# EAGLE design blink1_v2c3 (EAGLE 6.4)
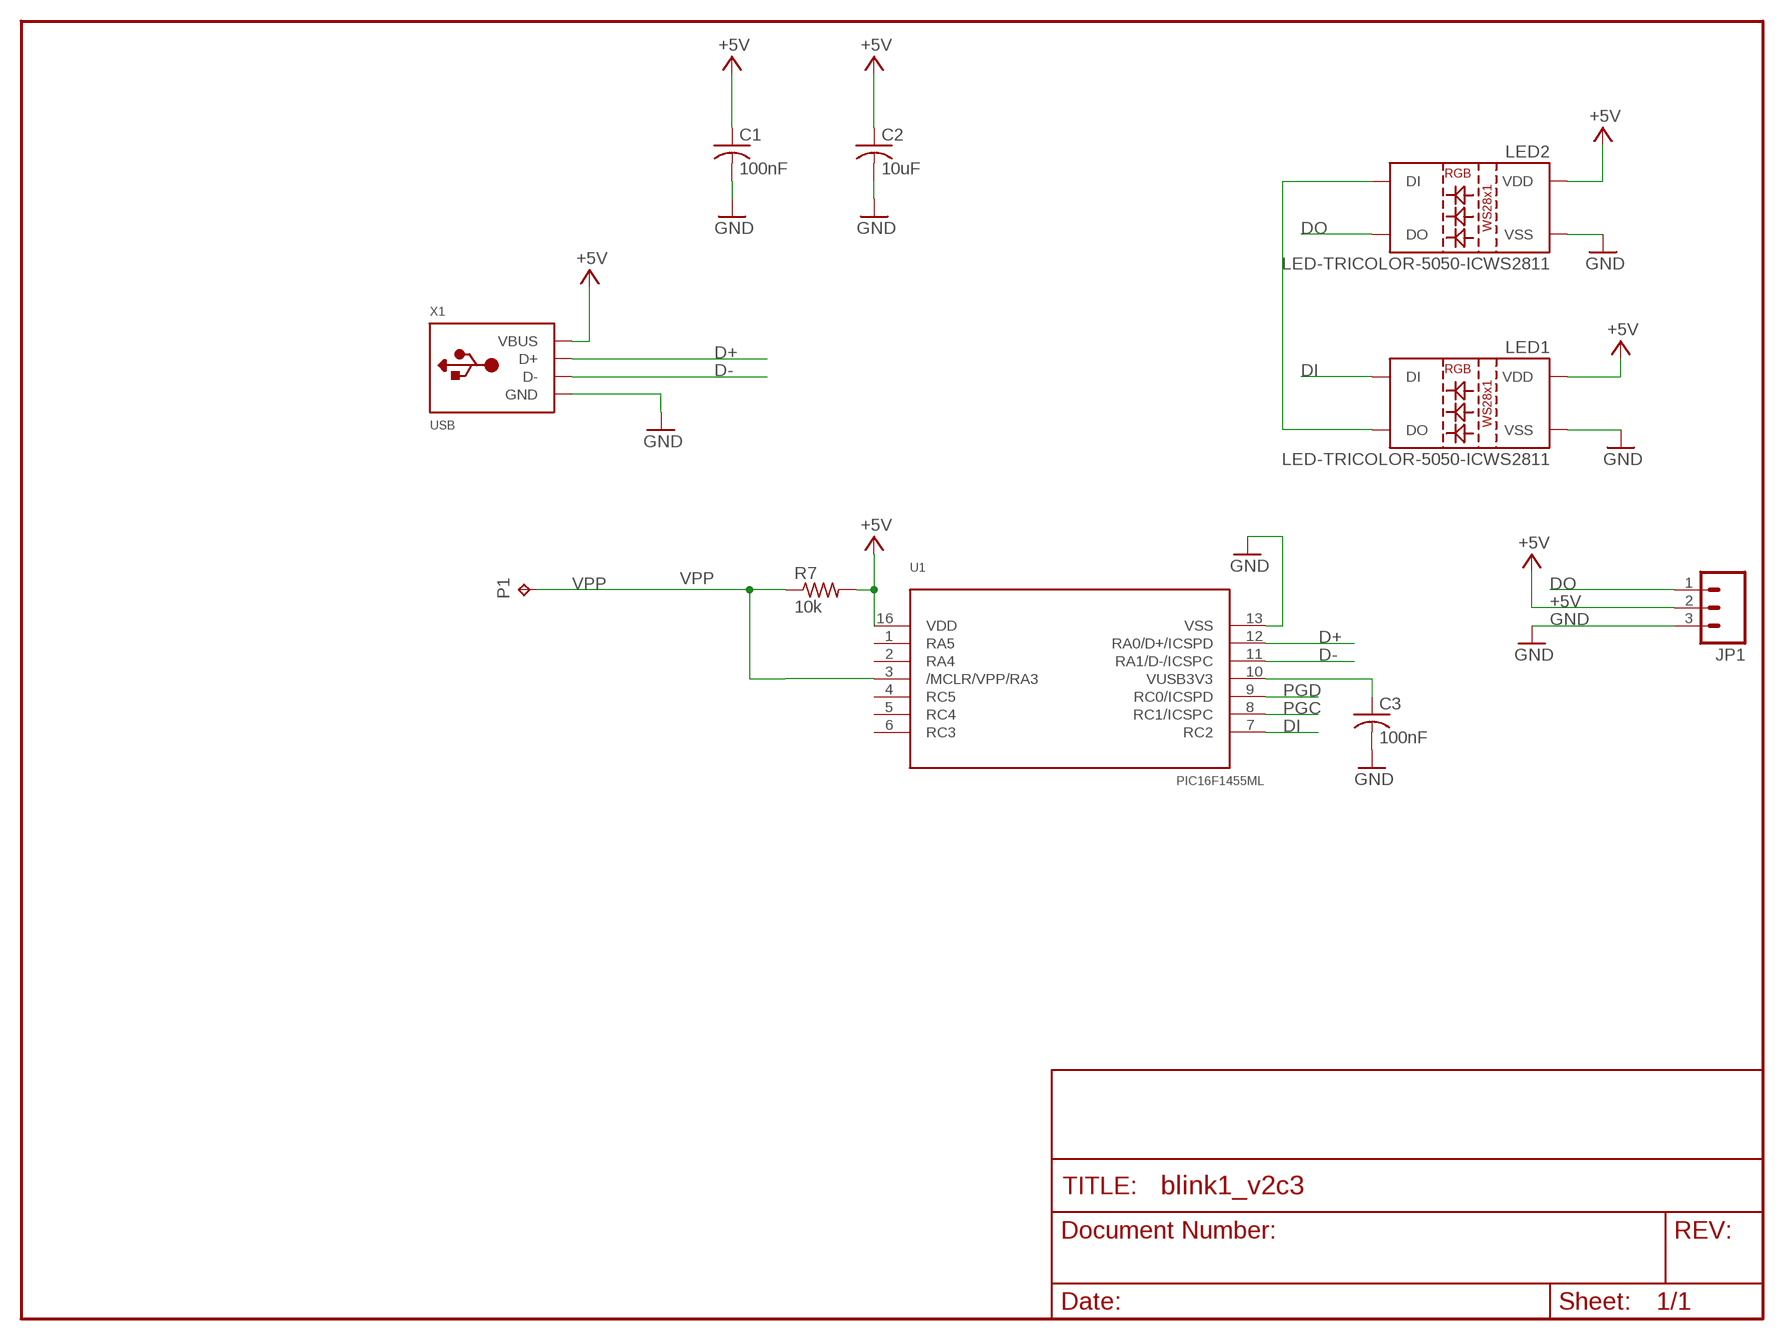
[diagram p0: schematic, sheet 1]

## Parts
C1  100nF  C-USC0603  [C0603]
C2  10uF  C-USC0603  [C0603]
C3  100nF  C-USC0603  [C0603]
JP1  M03PTH  [1X03]
LED1  LED-TRICOLOR-5050-ICWS2811  [LED-TRICOLOR-5050-IC]
LED2  LED-TRICOLOR-5050-ICWS2811  [LED-TRICOLOR-5050-IC]
P1  TPTP11SQ  [TP11SQ]
R7  10k  R-US_R0603  [R0603]
U1  PIC16F1455ML  [QFN16_4X4]
X1  USB  [MOLEX-48037-1000]

## Nets
+5V: C1.1 C2.1 JP1.2 LED1.3(VDD) LED1.5(VDD) LED2.3(VDD) LED2.5(VDD) R7.2 U1.16(VDD) X1.1(VBUS)
D+: U1.12(RA0/D+/ICSPD) X1.3(D+)
D-: U1.11(RA1/D-/ICSPC) X1.2(D-)
DI: LED1.2(DI) U1.7(RC2)
DO: JP1.1 LED2.1(DO)
GND: C1.2 C2.2 C3.2 JP1.3 LED1.6(VSS) LED2.6(VSS) U1.13(VSS) X1.4(GND)
N$1: LED1.1(DO) LED2.2(DI)
PGC: U1.8(RC1/ICSPC)
PGD: U1.9(RC0/ICSPD)
VPP: P1.TP R7.1 U1.3(/MCLR/VPP/RA3)
VUSB3V3: C3.1 U1.10(VUSB3V3)
Unconnected: U1.1(RA5) U1.2(RA4) U1.4(RC5) U1.5(RC4) U1.6(RC3)

## Library data of the parts
C1-C3 = rcl:C-US: CAPACITOR, American symbol
JP1 = SparkFun-20110517:M03: Header 3 Standard 3-pin 0.1" header. Use with straight break away headers (SKU : PRT-00116), right angle break away headers (PRT-00553), swiss pins (PRT-00743), machine pins (PRT-00117), and female headers (PRT-00115). Molex polarized connector foot print use with SKU : PRT-08232 with associated crimp pins and housings.
LED1 LED2 = SparkFun-LED:LED-TRICOLOR-5050-IC: 5x5mm SMD LED with built-in controller IC.
P1 = testpad:TP: Test pad
R7 = rcl:R-US_: RESISTOR, American symbol
U1 = todstuffnew:PIC16F1455
X1 = todstuff:USB

## Board
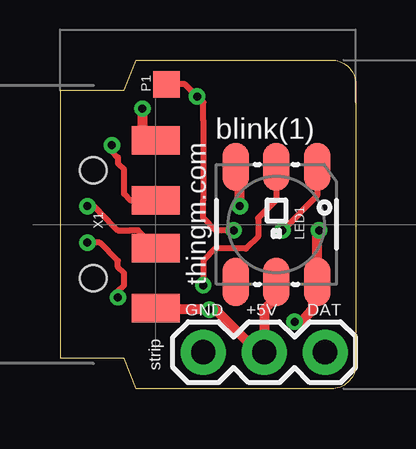
[diagram p1: board, top side]
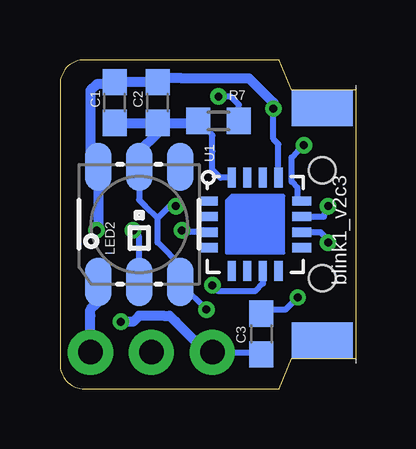
[diagram p2: board, bottom side, seen from below]

Size 12.32 x 13.72 mm. Coordinates in mm from the lower left corner, seen from the top.
Outline: 0,12.45 2.67,12.45 3.17,13.72 11.3,13.72 arc-90 12.32,12.7 12.32,1.02 arc-90 11.3,0 3.17,0 2.67,1.27 0,1.27 0,12.45
Copper layers (1*16): Top 0.0356mm / dielectric 1.5011mm / Bottom 0.0356mm
Design rules "LaenPCBOrder *": minimum track width 10mil, minimum drill 13mil, track to track 6mil, track to pad 8mil, pad to pad 8mil, via to via 8mil, smd to smd 6mil, copper to edge 15mil, drill to drill 8mil, minimum pad ring 7mil, minimum via ring 7mil, stop-mask expansion 4mil, vias tented up to drill 25mil, thermal gap 10mil
tRestrict: area -2.4,3 to -1.1,10.7

### Footprints (pad centres in the part's own frame; a part is rotated, then mirrored left to right if it is on the bottom)
C0603 = smd 1.1 x 1: 1 -0.85,0; 2 0.85,0
1X03 = drill 1.016 pad 1.88: 1 0,0; 2 2.54,0; 3 5.08,0
LED-TRICOLOR-5050-IC = smd 2 x 1.1: 1 -2.4,1.7; 2 -2.4,0; 3 -2.4,-1.7; 4 2.4,-1.7; 5 2.4,0; 6 2.4,1.7
TP11SQ = smd 1.1 x 1.1: TP 0,0
R0603 = smd 1 x 1.1: 1 -0.85,0; 2 0.85,0
QFN16_4X4 = smd 0.8 x 0.35: 1 -1.95,0.975; 2 -1.95,0.325; 3 -1.95,-0.325; 4 -1.95,-0.975; 9 1.95,-0.975; 10 1.95,-0.325; 11 1.95,0.325; 12 1.95,0.975 | smd 0.35 x 0.8: 5 -0.975,-1.95; 6 -0.325,-1.95; 7 0.325,-1.95; 8 0.975,-1.95; 13 0.975,1.95; 14 0.325,1.95; 15 -0.325,1.95; 16 -0.975,1.95
MOLEX-48037-1000 = smd 2 x 1.2: 1 2.6,-3.5; 2 2.6,-1; 3 2.6,1; 4 2.6,3.5 | smd 2.54 x 1.524 bottom: P$1 0,4.85; P$2 0,-4.85 | hole 1.1: 0,2.25; 0,-2.25

### Placement (x,y rotation side)
C1  10.03,11.94 90 bottom
C2  8.25,11.94 90 bottom
C3  3.94,2.29 270 bottom
JP1  strip  [1X03]  11.05,1.52 180 top
LED1  9.02,6.86 270 top
LED2  9.02,6.86 90 bottom
P1  4.45,12.7 0 top
R7  5.71,11.18 180 bottom
U1  4.19,6.86 0 bottom
X1  1.39,6.86 0 top

### Tracks (layer width: path | path; a pad name or v marks a point on that pad's centre or on a via)
+5V  (via drill 0.33)
  Top 0.254: 7.49,9.14 LED1.3 | 4.19,3.3 X1.1 | LED1.5 9.02,4.32 9.02,3.81
  Top 0.406: v7.49,7.62 7.49,9.14 | 4.19,3.3 v6.22,3.3 6.48,3.3 7.49,2.29 8.25,1.52 JP1.2 8.51,3.3 9.02,3.81
  Bottom 0.254: C2.1 8.51,11.18 C2.1 | 10.03,11.18 C1.1 | 8.25,10.67 C2.1 | 9.02,9.4 LED2.5 9.02,9.14 9.02,7.87 8.76,7.62 8.25,7.11 | 7.24,4.32 LED2.3 | 7.24,4.32 7.24,5.08 8.25,6.1 8.25,6.86 8.25,7.11 | 7.24,4.32 v6.22,3.3 | v7.49,7.62 7.75,7.62 8.25,7.11 | R7.2 5.97,10.58 5.97,9.91 5.97,9.14 5.63,8.81 U1.16
  Bottom 0.406: C1.1 C2.1 | C2.1 6.65,11.09 R7.2 | 9.02,9.14 9.02,9.91 8.25,10.67 C2.1
D+  (via drill 0.33)
  Top 0.254: X1.3 2.94,7.86 2.67,8.13 2.67,9.14 2.41,9.4 2.41,9.65 2.16,9.91 v2.16,10.16
  Bottom 0.254: U1.12 2.41,7.83 2.41,8.38 2.67,8.64 2.67,9.65 2.41,9.91 v2.16,10.16
D-  (via drill 0.33)
  Top 0.254: X1.2 3.24,6.6 2.92,6.6 2.41,6.6 1.65,7.37 1.4,7.62 v1.14,7.62
  Bottom 0.254: U1.11 1.33,7.18 v1.14,7.62
DI  (via drill 0.33)
  Top 0.254: v5.97,4.32 5.97,4.57 5.97,5.33 6.48,5.84 7.75,5.84 8.25,6.35 8.25,7.11 9.02,7.87 9.02,9.14 LED1.2
  Bottom 0.254: v5.97,4.32 5.71,4.06 4.19,4.06 3.87,4.39 U1.7
DO
  Bottom 0.406: JP1.1 11.05,3.05 11.05,3.3 10.79,3.56 10.79,4.38 LED2.1
GND  (via drill 0.33)
  Top 0.254: 3.43,10.92 3.94,10.41 X1.4 | 10.54,3.81 10.54,4.32 LED1.6
  Top 0.406: v3.43,11.68 3.43,10.92 | LED1.6 10.72,6.53 v10.79,6.6 | 10.54,3.81 10.54,3.3 10.29,3.05 10.03,2.79 v9.78,2.79
  Bottom 0.254: JP1.3 3.94,1.52 C3.2 | 10.03,12.7 C1.2 | U1.13 3.22,10.2 3.43,10.41 v3.43,11.68 | 11.05,9.59 LED2.6 | 8.51,12.7 C2.2 8.51,12.7
  Bottom 0.406: 10.03,12.7 10.79,12.7 11.05,12.45 11.05,9.59 | LED2.6 10.72,6.68 v10.79,6.6 | 3.43,11.94 v3.43,11.68 3.43,11.94 | C1.2 C2.2 8.34,12.95 7.24,12.95 4.45,12.95 3.43,11.94 | 6.22,1.52 JP1.3 6.22,1.52 | v9.78,2.79 9.27,2.79 9.02,3.05 8.76,3.05 8.25,3.05 8,3.05 7.75,3.05 7.49,2.79 6.22,1.52
N$1  (via drill 0.33)
  Top 0.254: LED1.1 10.72,8.05 v9.27,6.6
  Bottom 0.254: LED2.2 9.02,4.57 9.02,6.1 9.02,6.35 v9.27,6.6
VPP  (via drill 0.33)
  Top 0.254: P1.TP 5.21,12.7 v5.71,12.19 5.97,11.94 5.97,11.18 5.97,7.87 5.97,7.11 6.48,6.6 v7.24,6.6
  Bottom 0.254: U1.3 7.24,6.53 v7.24,6.6 | R7.1 4.87,11.85 5.21,12.19 v5.71,12.19
VUSB3V3  (via drill 0.33)
  Top 0.254: v2.41,3.81 2.41,4.06 2.67,4.32 2.67,4.83 2.41,5.08 2.41,5.33 1.65,6.1 v1.14,6.1
  Bottom 0.254: v2.41,3.81 2.92,3.3 3.94,3.3 C3.1 | U1.10 1.47,6.53 1.14,6.21 v1.14,6.1

### Text on the board
tPlace: blink(1) | thingm.com | GND | +5V | DAT | strip
bPlace: blink1_v2c3